# EasyEDA schematic ORIONRP2350.json
TITLE: ORION RP2350; REV: 1.0; Date: 2026-09-20; Sheet: 1/1; Drawn By: zorp_; Company: MUSTAFA BERISHA
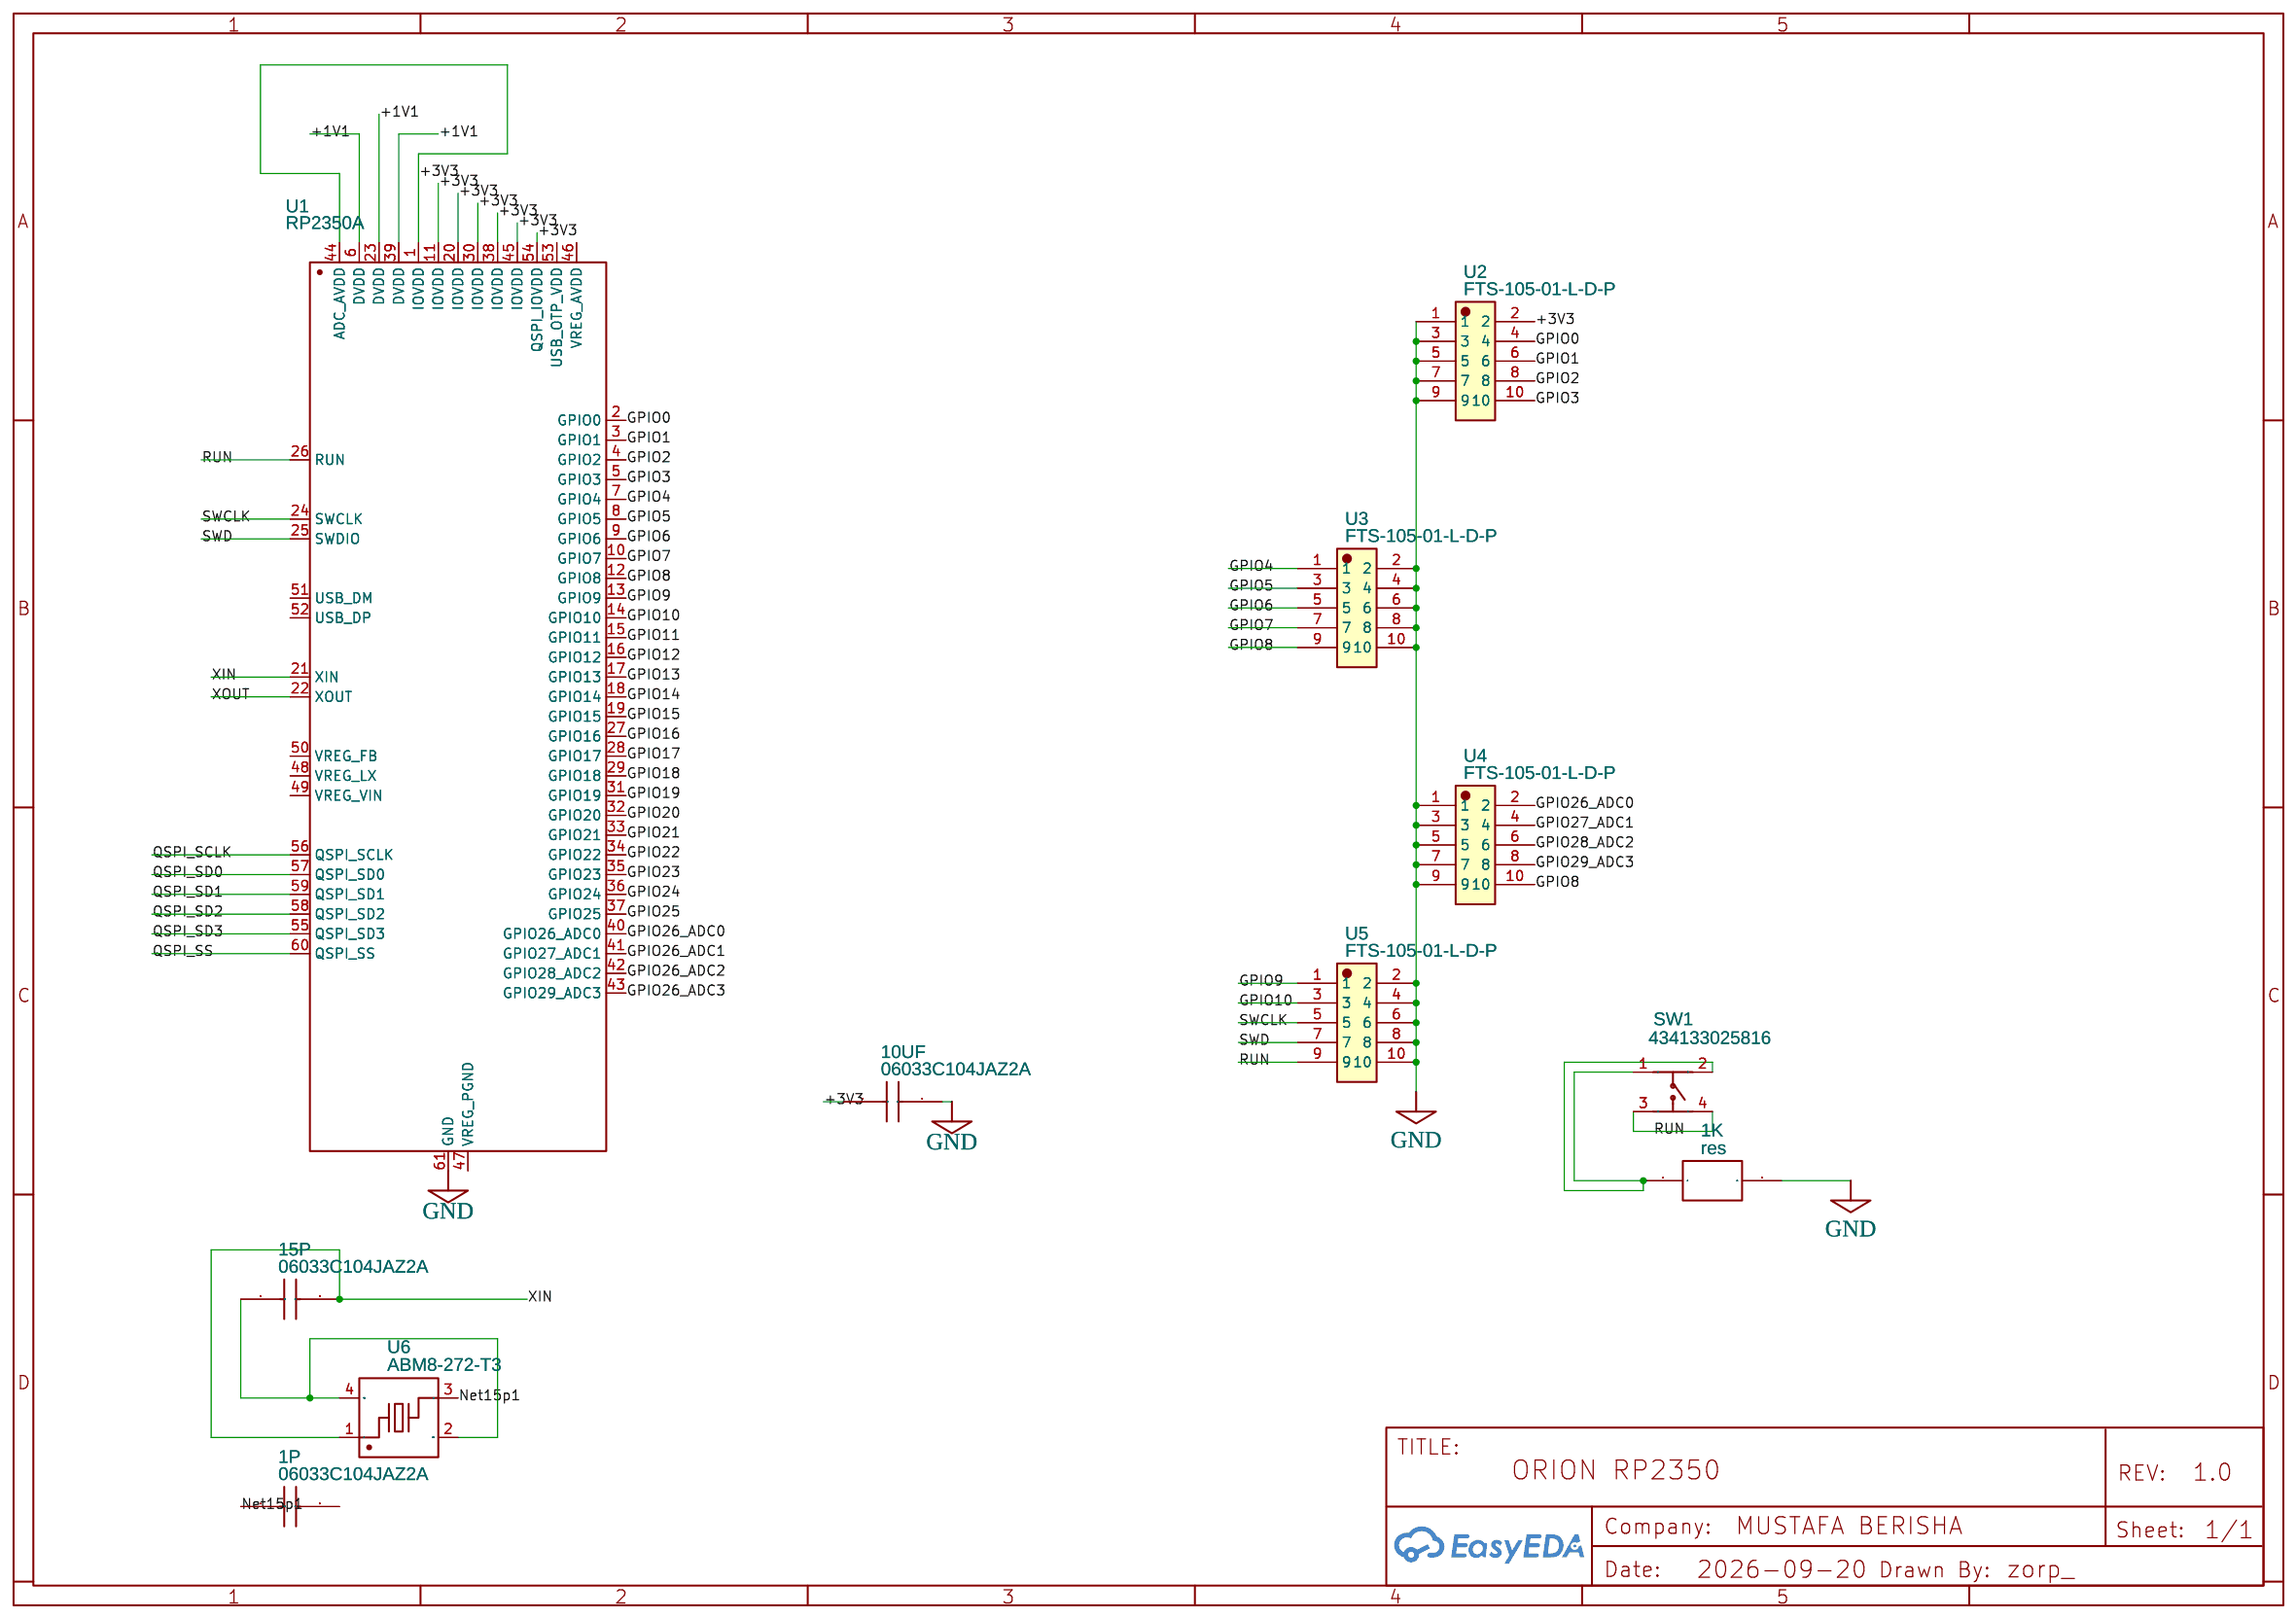
[diagram p0: schematic sheet]

## Parts
1K  res  [SMD-RESISTOR]
1P  06033C104JAZ2A  [CAPASITOR_0603_MLCC_SHURA]
10UF  06033C104JAZ2A  [CAPASITOR_0603_MLCC_SHURA]
15P  06033C104JAZ2A  [CAPASITOR_0603_MLCC_SHURA]
SW1  434133025816  [SW-SMD_4P-L4.2-W3.2-P2.15-LS4.6]
U1  RP2350A  [QFN-60_L7.0-W7.0-P0.40-TL-EP3.4]
U2  FTS-105-01-L-D-P  [FTS-105-01-F-D]
U3  FTS-105-01-L-D-P  [FTS-105-01-F-D]
U4  FTS-105-01-L-D-P  [FTS-105-01-F-D]
U5  FTS-105-01-L-D-P  [FTS-105-01-F-D]
U6  ABM8-272-T3  [CRYSTAL-SMD_4P-L3.2-W2.5-BL-2]

## Library data of the parts
1K = res: Contributor: iasm752
1P 10UF 15P = 06033C104JAZ2A: Datasheet Link: https://componentsearchengine.com/Datasheets/1/06031A100FAT2A.pdf; Height: 0.9mm; Manufacturer_Name: AVX; Mouser Part Number: 581-06033C104JAZ2A; Mouser Price/Stock: https://www.mouser.co.uk/ProductDetail/AVX/06033C104JAZ2A/?qs=ZBeOGGPQgEF3HuLfD2k6PQ%3D%3D; Contributor: oleg63
SW1 = 434133025816: Supplier: LCSC; Supplier Part: C5504987; Manufacturer: Wurth(伍尔特); JLCPCB Part Class: Extended Part; Contributor: lcsc
U1 = RP2350A: Supplier: LCSC; Supplier Part: C9900136995; Manufacturer: null; JLCPCB Part Class: Extended Part; Contributor: lcsc
U2-U5 = FTS-105-01-L-D-P: Supplier: Mouser; Supplier Part: 200-FTS10501LDP; link: https://www.mouser.fr/ProductDetail/Samtec/FTS-105-01-L-D-P?qs=Cqqh%252BS766wmXh%2FxfxY38TA%3D%3D; Contributor: elw_td
U6 = ABM8-272-T3: Supplier: LCSC; Supplier Part: C9900091606; Manufacturer: null; Contributor: lcsc

## Nets
+1V1: U1.6(DVDD) U1.23(DVDD) U1.39(DVDD)
+3V3: 10UF.1 U1.1(IOVDD) U1.11(IOVDD) U1.20(IOVDD) U1.30(IOVDD) U1.38(IOVDD) U1.44(ADC_AVDD) U1.45(IOVDD) U1.54(QSPI_IOVDD) U2.2
GND: 1K.2 10UF.2 U1.61(GND) U2.1 U2.3 U2.5 U2.7 U2.9 U3.2 U3.4 U3.6 U3.8 U3.10 U4.1 U4.3 U4.5 U4.7 U4.9 U5.2 U5.4 U5.6 U5.8 U5.10
GPIO0: U1.2(GPIO0) U2.4
GPIO1: U1.3(GPIO1) U2.6
GPIO2: U1.4(GPIO2) U2.8
GPIO3: U1.5(GPIO3) U2.10
GPIO4: U1.7(GPIO4) U3.1
GPIO5: U1.8(GPIO5) U3.3
GPIO6: U1.9(GPIO6) U3.5
GPIO7: U1.10(GPIO7) U3.7
GPIO8: U1.12(GPIO8) U3.9 U4.10
GPIO9: U1.13(GPIO9) U5.1
GPIO10: U1.14(GPIO10) U5.3
GPIO11: U1.15(GPIO11)
GPIO12: U1.16(GPIO12)
GPIO13: U1.17(GPIO13)
GPIO14: U1.18(GPIO14)
GPIO15: U1.19(GPIO15)
GPIO16: U1.27(GPIO16)
GPIO17: U1.28(GPIO17)
GPIO18: U1.29(GPIO18)
GPIO19: U1.31(GPIO19)
GPIO20: U1.32(GPIO20)
GPIO21: U1.33(GPIO21)
GPIO22: U1.34(GPIO22)
GPIO23: U1.35(GPIO23)
GPIO24: U1.36(GPIO24)
GPIO25: U1.37(GPIO25)
GPIO26_ADC0: U1.40(GPIO26_ADC0) U4.2
GPIO26_ADC1: U1.41(GPIO27_ADC1)
GPIO26_ADC2: U1.42(GPIO28_ADC2)
GPIO26_ADC3: U1.43(GPIO29_ADC3)
GPIO27_ADC1: U4.4
GPIO28_ADC2: U4.6
GPIO29_ADC3: U4.8
Net15p1: 1P.1 U6.3
QSPI_SCLK: U1.56(QSPI_SCLK)
QSPI_SD0: U1.57(QSPI_SD0)
QSPI_SD1: U1.59(QSPI_SD1)
QSPI_SD2: U1.58(QSPI_SD2)
QSPI_SD3: U1.55(QSPI_SD3)
QSPI_SS: U1.60(QSPI_SS)
RUN: SW1.3 SW1.4 U1.26(RUN) U5.9
SWCLK: U1.24(SWCLK) U5.5
SWD: U1.25(SWDIO) U5.7
XIN: 15P.2 U1.21(XIN) U6.1
XOUT: U1.22(XOUT)
Net-(1K-1): 1K.1 SW1.1 SW1.2
Net-(15P-1): 15P.1 U6.2(GND) U6.4(GND)

Not connected (* = marked no-connect by the designer): 1P 2; U1 46(VREG_AVDD) 47(VREG_PGND) 48(VREG_LX) 49(VREG_VIN) 50(VREG_FB) 51(USB_DM) 52(USB_DP) 53(USB_OTP_VDD)
